# Altium schematic sheet DRV8711EVM_FET.SchDoc
size B
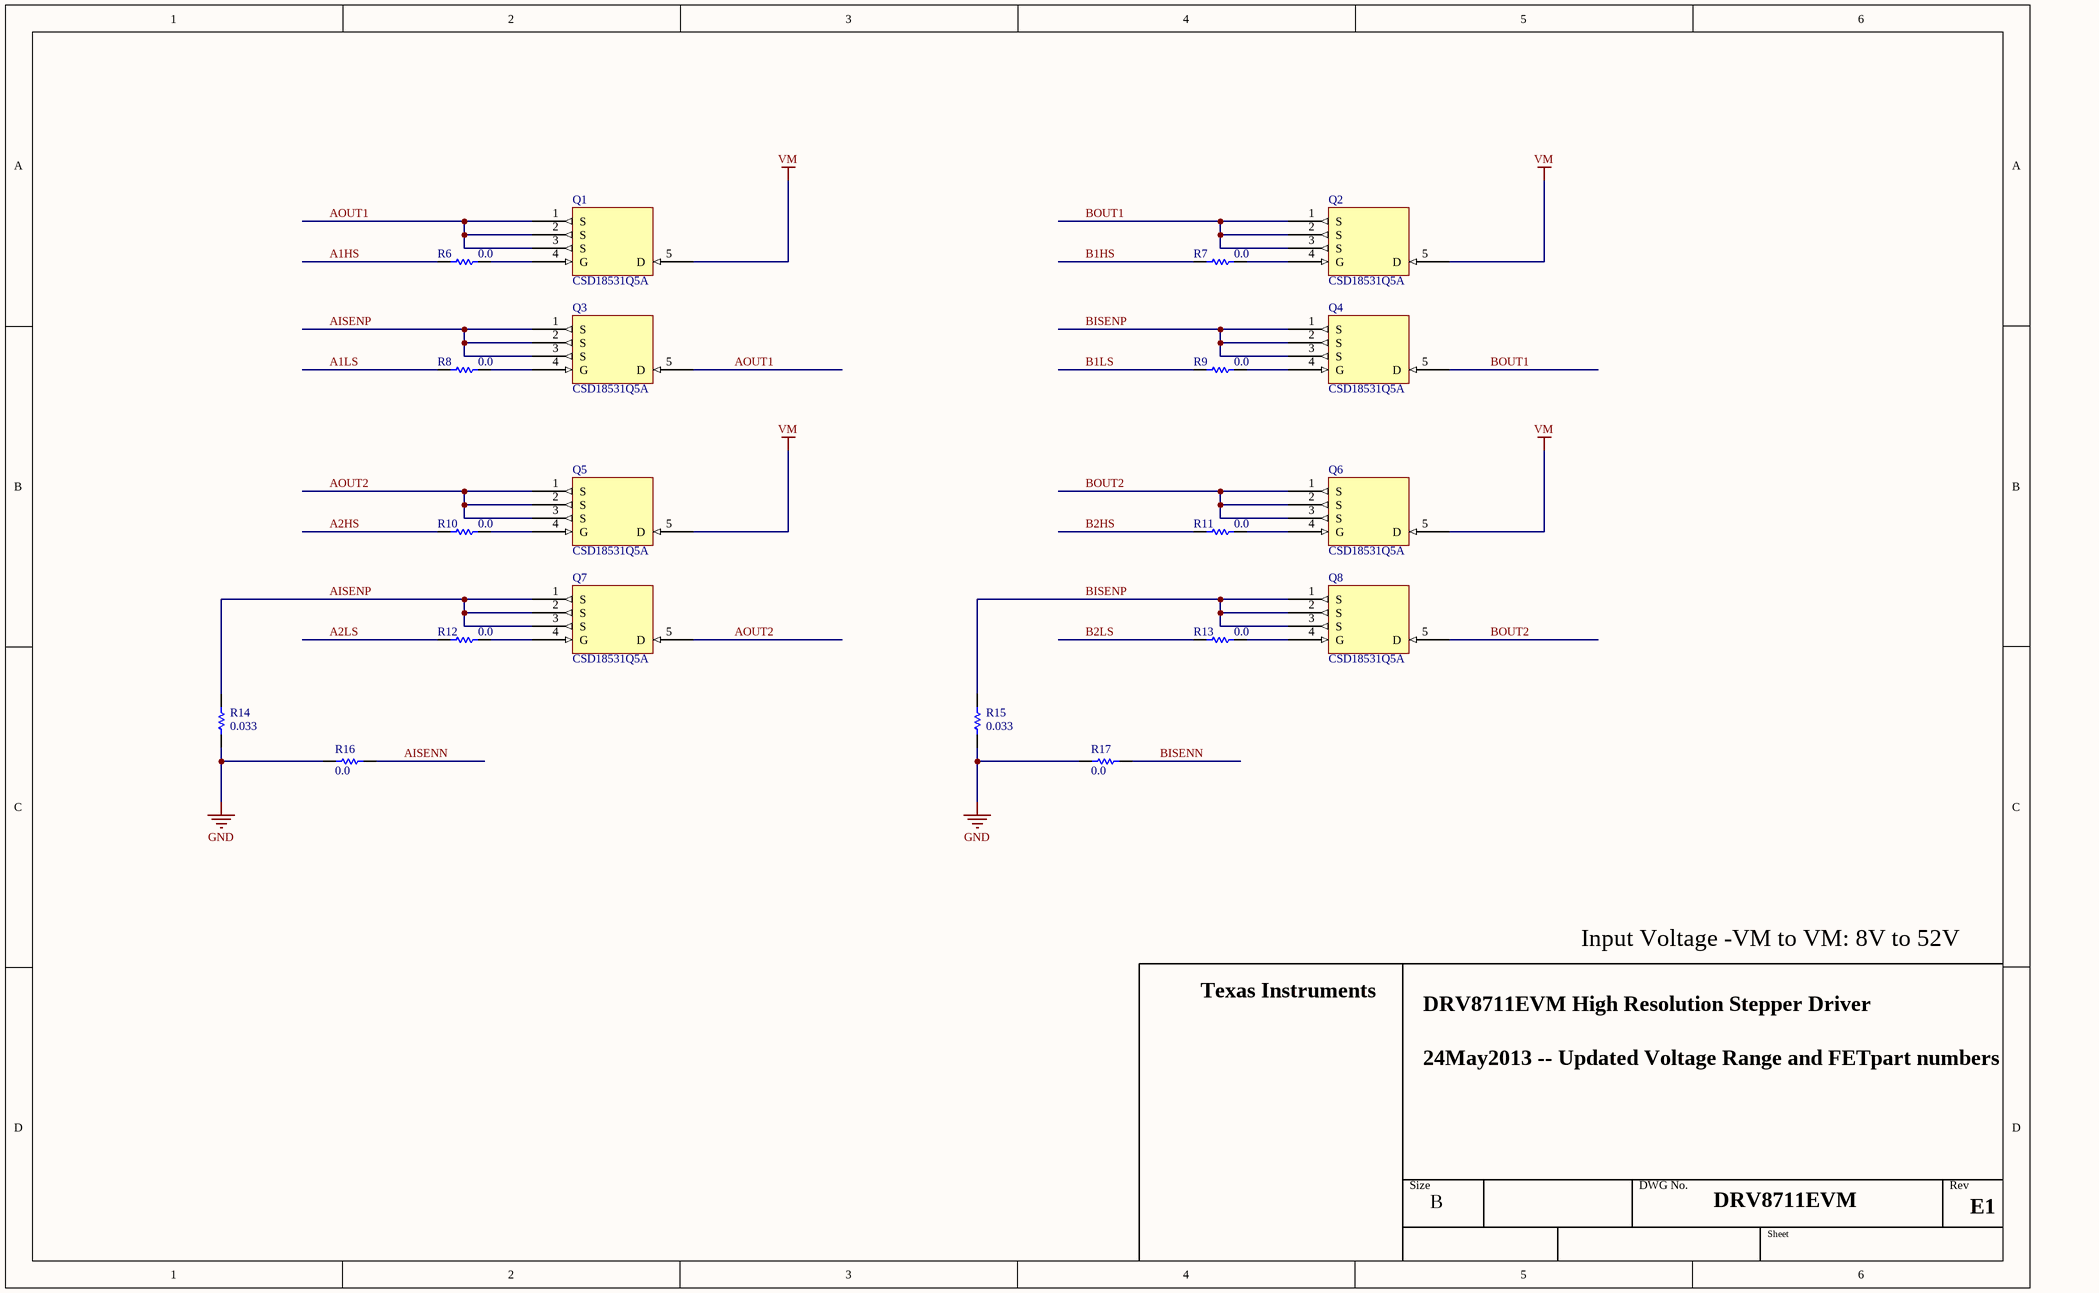
[diagram p0: DRV8711EVM_FET.SchDoc]

## Parts
Q1  CSD18531Q5A
Q2  CSD18531Q5A
Q3  CSD18531Q5A
Q4  CSD18531Q5A
Q5  CSD18531Q5A
Q6  CSD18531Q5A
Q7  CSD18531Q5A
Q8  CSD18531Q5A
R6  value 0.0  [0603-SMT]
R7  value 0.0  [0603-SMT]
R8  value 0.0  [0603-SMT]
R9  value 0.0  [0603-SMT]
R10  value 0.0  [0603-SMT]
R11  value 0.0  [0603-SMT]
R12  value 0.0  [0603-SMT]
R13  value 0.0  [0603-SMT]
R14  0.033  [2818]
R15  0.033  [2818]
R16  value 0.0  [0603-SMT]
R17  value 0.0  [0603-SMT]

## Nets
GND: R14.1 R15.1 R16.2 R17.2
VM: Q1.5(D) Q2.5(D) Q5.5(D) Q6.5(D)
A1HS: R6.1
A1LS: R8.1
A2HS: R10.1
A2LS: R12.1
AISENN: R16.1
AISENP: Q3.1(S) Q3.2(S) Q3.3(S) Q7.1(S) Q7.2(S) Q7.3(S) R14.2
AOUT1: Q1.1(S) Q1.2(S) Q1.3(S) Q3.5(D)
AOUT2: Q5.1(S) Q5.2(S) Q5.3(S) Q7.5(D)
B1HS: R7.1
B1LS: R9.1
B2HS: R11.1
B2LS: R13.1
BISENN: R17.1
BISENP: Q4.1(S) Q4.2(S) Q4.3(S) Q8.1(S) Q8.2(S) Q8.3(S) R15.2
BOUT1: Q2.1(S) Q2.2(S) Q2.3(S) Q4.5(D)
BOUT2: Q6.1(S) Q6.2(S) Q6.3(S) Q8.5(D)
NetQ1_4: Q1.4(G) R6.2
NetQ2_4: Q2.4(G) R7.2
NetQ3_4: Q3.4(G) R8.2
NetQ4_4: Q4.4(G) R9.2
NetQ5_4: Q5.4(G) R10.2
NetQ6_4: Q6.4(G) R11.2
NetQ7_4: Q7.4(G) R12.2
NetQ8_4: Q8.4(G) R13.2

## Notes on the sheet
- Input Voltage -VM to VM: 8V to 52V
- Texas Instruments
- DRV8711EVM High Resolution Stepper Driver
- 24May2013 -- Updated Voltage Range and FETpart numbers
- Size
- B
- DWG No.
- DRV8711EVM
- Sheet
- Rev
- E1

## Library data of the parts
Q1-Q8 = IRLH5034: MOSFET N-CH 60V 8SON; Manufacturer: Texas Instruments; DK Part Number: CSD18531Q5A; MFG Part Number: CSD18531Q5A; Value: MOSFET
R6-R13 R16 R17 = Res1: RES 0.0 OHM 1/10W 0603 SMD; Manufacturer: Panasonic; MFG Part Number: ERJ-3GEY0R00V; DK Part Number: P0.0GCT-ND
R14 R15 = Res1: Resistor; MFG Part Number: WSH2818R0330FEA; Manufacturer: Vishay; DK Part Number: WSHA-.033CT-ND; Value: 0.033